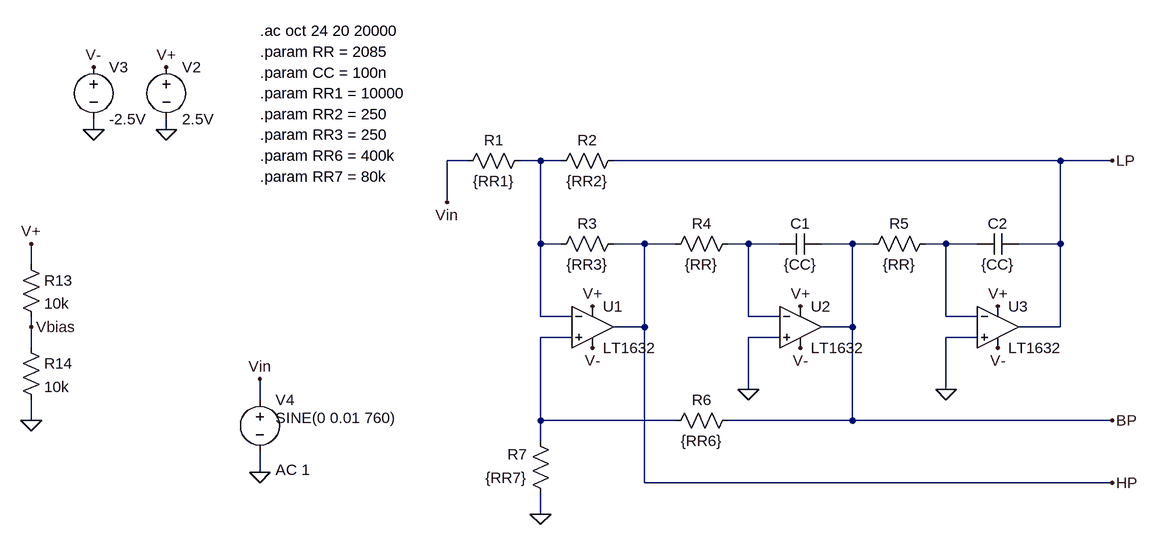
[diagram p0: schematic AnalogStateVar_AC_DualSupply.asc]
AnalogStateVar_AC_DualSupply.asc, the LTspice schematic file:
Version 4
SHEET 1 1800 3212
WIRE -608 480 -608 464
WIRE -496 480 -496 464
WIRE -32 528 -64 528
WIRE 80 528 48 528
WIRE 112 528 80 528
WIRE 880 528 192 528
WIRE 960 528 880 528
WIRE -64 592 -64 528
WIRE 80 656 80 528
WIRE 112 656 80 656
WIRE 240 656 192 656
WIRE 288 656 240 656
WIRE 400 656 368 656
WIRE 448 656 400 656
WIRE 560 656 512 656
WIRE 592 656 560 656
WIRE 704 656 672 656
WIRE 752 656 704 656
WIRE 880 656 880 528
WIRE 880 656 816 656
WIRE -704 688 -704 656
WIRE 80 768 80 656
WIRE 128 768 80 768
WIRE 400 768 400 656
WIRE 448 768 400 768
WIRE 704 768 704 656
WIRE 752 768 704 768
WIRE -704 784 -704 768
WIRE 240 784 240 656
WIRE 240 784 192 784
WIRE 560 784 560 656
WIRE 560 784 512 784
WIRE 880 784 880 656
WIRE 880 784 816 784
WIRE 128 800 80 800
WIRE 448 800 400 800
WIRE 752 800 704 800
WIRE -704 816 -704 784
WIRE 400 880 400 800
WIRE 704 880 704 800
WIRE -352 896 -352 864
WIRE -704 928 -704 896
WIRE 80 928 80 800
WIRE 288 928 80 928
WIRE 560 928 560 784
WIRE 560 928 368 928
WIRE 960 928 560 928
WIRE 80 960 80 928
WIRE -352 1008 -352 976
WIRE 240 1024 240 784
WIRE 960 1024 240 1024
WIRE 80 1072 80 1040
FLAG -608 480 0
FLAG -496 480 0
FLAG -496 384 V+
FLAG -608 384 V-
FLAG -352 1008 0
FLAG -704 928 0
FLAG -704 656 V+
FLAG -704 784 Vbias
FLAG -352 864 Vin
FLAG -64 592 Vin
FLAG 960 528 LP
FLAG 960 928 BP
FLAG 960 1024 HP
FLAG 80 1072 0
FLAG 160 752 V+
FLAG 480 752 V+
FLAG 784 752 V+
FLAG 160 816 V-
FLAG 480 816 V-
FLAG 784 816 V-
FLAG 704 880 0
FLAG 400 880 0
SYMBOL voltage -496 368 R0
WINDOW 123 0 0 Left 0
WINDOW 39 0 0 Left 0
SYMATTR InstName V2
SYMATTR Value 2.5V
SYMBOL voltage -608 368 R0
WINDOW 123 0 0 Left 0
WINDOW 39 0 0 Left 0
SYMATTR InstName V3
SYMATTR Value -2.5V
SYMBOL voltage -352 880 R0
WINDOW 123 24 124 Left 2
WINDOW 39 0 0 Left 0
WINDOW 3 24 44 Left 2
SYMATTR Value2 AC 1
SYMATTR Value SINE(0 0.01 760)
SYMATTR InstName V4
SYMBOL res -720 672 R0
SYMATTR InstName R13
SYMATTR Value 10k
SYMBOL res -720 800 R0
SYMATTR InstName R14
SYMATTR Value 10k
SYMBOL Opamps\\LT1632 160 720 R0
SYMATTR InstName U1
SYMBOL Opamps\\LT1632 480 720 R0
SYMATTR InstName U2
SYMBOL Opamps\\LT1632 784 720 R0
SYMATTR InstName U3
SYMBOL res 208 640 R90
WINDOW 0 0 56 VBottom 2
WINDOW 3 32 56 VTop 2
SYMATTR InstName R3
SYMATTR Value {RR3}
SYMBOL res 384 640 R90
WINDOW 0 0 56 VBottom 2
WINDOW 3 32 56 VTop 2
SYMATTR InstName R4
SYMATTR Value {RR}
SYMBOL cap 512 640 R90
WINDOW 0 0 32 VBottom 2
WINDOW 3 32 32 VTop 2
SYMATTR InstName C1
SYMATTR Value {CC}
SYMBOL res 688 640 R90
WINDOW 0 0 56 VBottom 2
WINDOW 3 32 56 VTop 2
SYMATTR InstName R5
SYMATTR Value {RR}
SYMBOL cap 816 640 R90
WINDOW 0 0 32 VBottom 2
WINDOW 3 32 32 VTop 2
SYMATTR InstName C2
SYMATTR Value {CC}
SYMBOL res 384 912 R90
WINDOW 0 0 56 VBottom 2
WINDOW 3 32 56 VTop 2
SYMATTR InstName R6
SYMATTR Value {RR6}
SYMBOL res 96 1056 R180
WINDOW 0 36 76 Left 2
WINDOW 3 36 40 Left 2
SYMATTR InstName R7
SYMATTR Value {RR7}
SYMBOL res 64 512 R90
WINDOW 0 0 56 VBottom 2
WINDOW 3 32 56 VTop 2
SYMATTR InstName R1
SYMATTR Value {RR1}
SYMBOL res 208 512 R90
WINDOW 0 0 56 VBottom 2
WINDOW 3 32 56 VTop 2
SYMATTR InstName R2
SYMATTR Value {RR2}
TEXT -352 328 Left 2 !.ac oct 24 20 20000
TEXT -352 392 Left 2 !.param CC = 100n
TEXT -352 424 Left 2 !.param RR1 = 10000
TEXT -352 456 Left 2 !.param RR2 = 250
TEXT -352 488 Left 2 !.param RR3 = 250
TEXT -352 520 Left 2 !.param RR6 = 400k
TEXT -352 360 Left 2 !.param RR = 2085
TEXT -352 552 Left 2 !.param RR7 = 80k

The netlist it stands for:
* AnalogStateVar_AC_DualSupply.asc
V2 V+ 0 2.5V
V3 V- 0 -2.5V
V4 Vin 0 SINE(0 0.01 760) AC 1
R13 V+ Vbias 10k
R14 Vbias 0 10k
XU1 N004 N001 V+ V- HP LT1632  ; pins In+ In- V+ V- OUT
XU2 0 N002 V+ V- BP LT1632  ; pins In+ In- V+ V- OUT
XU3 0 N003 V+ V- LP LT1632  ; pins In+ In- V+ V- OUT
R3 HP N001 {RR3}
R4 N002 HP {RR}
C1 BP N002 {CC}
R5 N003 BP {RR}
C2 LP N003 {CC}
R6 BP N004 {RR6}
R7 0 N004 {RR7}
R1 N001 Vin {RR1}
R2 LP N001 {RR2}
.ac oct 24 20 20000
.param CC = 100n
.param RR1 = 10000
.param RR2 = 250
.param RR3 = 250
.param RR6 = 400k
.param RR = 2085
.param RR7 = 80k
.lib LTC.lib
.backanno
.end